# Altium schematic sheet HEADERS_JCTL.SchDoc: JCTL
size A3; Author: Silvio Navaretti; CompanyName: ARDUINO; DrawnBy: Silvio Navaretti; Engineer: Silvio Navaretti; Organization: ARDUINO; SheetNumber: 23; SheetTotal: 51; RevAuthor: Silvio Navaretti
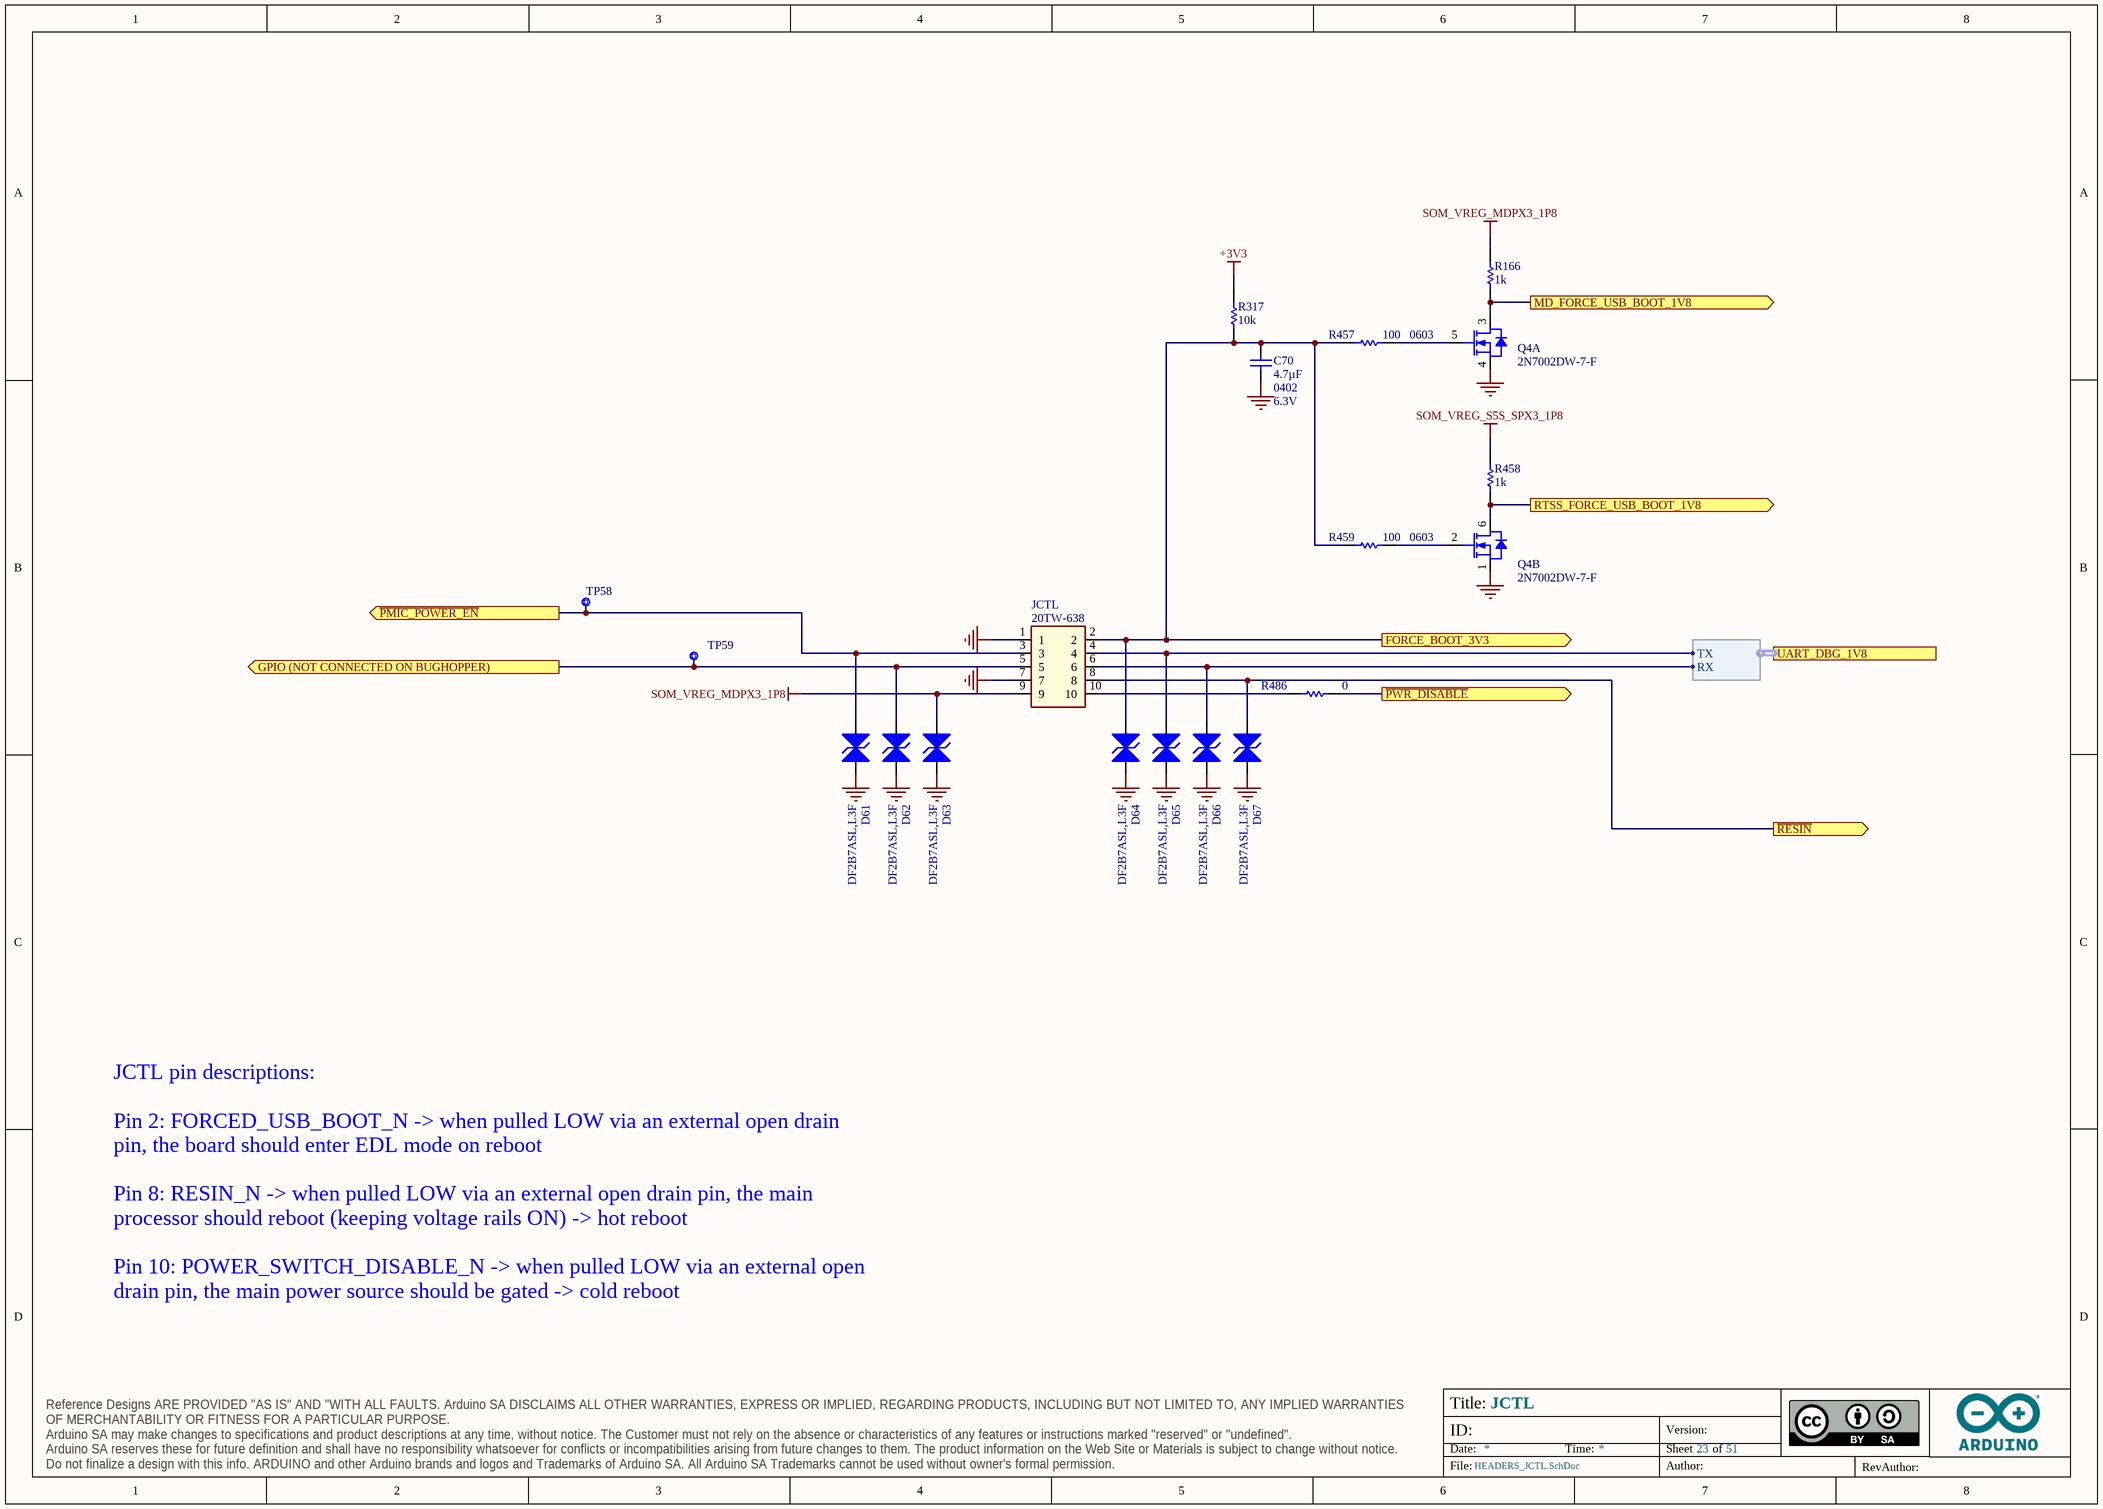
[diagram p0: HEADERS_JCTL.SchDoc]

## Parts
C70  value 4.7µF  Case Code (Imperial): 0402  Voltage: 6.3V  [CAP-0402]  (hidden comment: C1005A475M6R3NT)
D61  DF2B7ASL,L3F  [DF2B7ASL,L3F]
D62  DF2B7ASL,L3F  [DF2B7ASL,L3F]
D63  DF2B7ASL,L3F  [DF2B7ASL,L3F]
D64  DF2B7ASL,L3F  [DF2B7ASL,L3F]
D65  DF2B7ASL,L3F  [DF2B7ASL,L3F]
D66  DF2B7ASL,L3F  [DF2B7ASL,L3F]
D67  DF2B7ASL,L3F  [DF2B7ASL,L3F]
JCTL  20TW-638  [20TW-638]
Q4  2N7002DW-7-F  [SOT363]  (parts A,B of 2)
R166  value 1k  [RES-0201]  (hidden comment: RC0201FR-071KL)
R317  value 10k  [RES-0201]  (hidden comment: RC0201FR-0710KL)
R457  value 100  Case Code (Imperial): 0603  [RES-0603]  (hidden comment: CRCW0603100RFKEAC)
R458  value 1k  [RES-0201]  (hidden comment: RC0201FR-071KL)
R459  value 100  Case Code (Imperial): 0603  [RES-0603]  (hidden comment: CRCW0603100RFKEAC)
R486  value 0  [RES-0201]  (hidden comment: CRCW02010000Z0ED)
TP58  Test point 1.00mm  [TP-1.00MM]  (value not drawn)  (no BOM)
TP59  Test point 1.00mm  [TP-1.00MM]  (value not drawn)  (no BOM)

## Ports
FORCE_BOOT_3V3 (out), GPIO (NOT CONNECTED ON BUGHOPPER) (out), MD_FORCE_USB_BOOT_1V8 (out), RTSS_FORCE_USB_BOOT_1V8 (out), UART_DBG_1V8 (harness UART), ~{PMIC_POWER_EN} (out), ~{PWR_DISABLE} (out), ~{RESIN} (out)

## Harnesses
UART: TX, RX

## Nets
+3V3: R317.2
GND: C70.2 D61.1(A1) D62.1(A1) D63.1(A1) D64.1(A1) D65.1(A1) D66.1(A1) D67.1(A1) JCTL.1 JCTL.7 Q4.1(S) Q4.4(S)
SOM_VREG_MDPX3_1P8: D63.2(A2) JCTL.9 R166.1
SOM_VREG_S5S_SPX3_1P8: R458.1
FORCE_BOOT_3V3: C70.1 D64.2(A2) JCTL.2 R317.1 R457.2 R459.2 ; port FORCE_BOOT_3V3
GPIO (NOT CONNECTED ON BUGHOPPER): D62.2(A2) JCTL.5 TP59.X ; port GPIO (NOT CONNECTED ON BUGHOPPER)
MD_FORCE_USB_BOOT_1V8: Q4.3(D) R166.2 ; port MD_FORCE_USB_BOOT_1V8
~{PMIC_POWER_EN}: D61.2(A2) JCTL.3 TP58.X ; port ~{PMIC_POWER_EN}
~{PWR_DISABLE}: R486.1 ; port ~{PWR_DISABLE}
~{RESIN}: D67.2(A2) JCTL.8 ; port ~{RESIN}
RTSS_FORCE_USB_BOOT_1V8: Q4.6(D) R458.2 ; port RTSS_FORCE_USB_BOOT_1V8
NetD65_2: D65.2(A2) JCTL.4 ; port UART_DBG_1V8.TX
NetD66_2: D66.2(A2) JCTL.6 ; port UART_DBG_1V8.RX
NetJCTL_10: JCTL.10 R486.2
NetQ4_2: Q4.2(G) R459.1
NetQ4_5: Q4.5(G) R457.1

## Notes on the sheet
- JCTL pin descriptions:
  Pin 2: FORCED_USB_BOOT_N -> when pulled LOW via an external open drain pin, the board should enter EDL mode on reboot
  Pin 8: RESIN_N -> when pulled LOW via an external open drain pin, the main processor should reboot (keeping voltage rails ON) -> hot reboot
  Pin 10: POWER_SWITCH_DISABLE_N -> when pulled LOW via an external open drain pin, the main power source should be gated -> cold reboot
- Title:
- ID:
- Date:
- Time:
- Version:
- Sheet
- of
- RevAuthor:
- Reference Designs ARE PROVIDED "AS IS" AND "WITH ALL FAULTS. Arduino SA DISCLAIMS ALL OTHER WARRANTIES, EXPRESS OR IMPLIED, REGARDING PRODUCTS, INCLUDING BUT NOT LIMITED TO, ANY IMPLIED WARRANTIES OF MERCHANTABILITY OR FITNESS FOR A PARTICULAR PURPOSE.
  Arduino SA may make changes to specifications and product descriptions at any time, without notice. The Customer must not rely on the absence or characteristics of any features or instructions marked "reserved" or "undefined".
  Arduino SA reserves these for future definition and shall have no responsibility whatsoever for conflicts or incompatibilities arising from future changes to them. The product information on the Web Site or Materials is subject to change without notice.
  Do not finalize a design with this info. ARDUINO and other Arduino brands and logos and Trademarks of Arduino SA. All Arduino SA Trademarks cannot be used without owner's formal permission.
- File:
- Author:

## Library data of the parts
C70 = C0037-A.14: CAP CHIP 0402 4.7uF 20% 6V3 X5R; Manufacturer: Hottech; Code Arduino: 0833; Dielectric: X5R; Technology: Ceramic; Part Number: C1005A475M6R3NT; Manufacturer 2: Samsung Electro-Mechanics; Tolerance: 20%; Manufacturer 3: Murata Electronics; Part number 3: GRM155R60J475ME47D; Part number 2: CL05A475KQ5NRNC
D61-D67 = D0099-5: TVS BIDIRECTIONAL SMD Vr 5.5V, Vbr min 5.8V, 0.62x0.32mm; Manufacturer: TOSHIBA; Vforward max: 0V; Ireverse max: 1µA; Power max: 80W; Code Arduino: D0099; Vreverse max: 20V; V(BR) min: 5.8V; V(RWM) max: 5.5V; Part Number: DF2B7ASL,L3F
JCTL = J0570-A.1: CONN HEADER MALE 10POS 2x5 2.54mm SMD; Manufacturer: 4UCONN; Number of Contacts: 10; Connector Type: BOARD CONNECTOR; Code Arduino: J0570; Contact Material: Gold; Part Number: 20TW-638; Termination: SMD/SMT; Insulation Color: Black
Q4 = T0011-A.12: MOSFET 2N-CH 60V 0.32A SOT363; Manufacturer: Diodes Inc.; Device Type: Mosfet 2N-CH SMD; Code Arduino: A5500; Manufacturer 2: Nexperia; Manufacturer Part Number 2: 2N7002PS,115; Pin Count: 6; Part Number: 2N7002DW-7-F
R166 R458 = R0195-A.22: RES CHIP 0201 1k 1% 1/20W; Manufacturer: Yageo; Power: 50mW; Temperature coefficient: 200ppm; Code Arduino: R0195; Tolerance: 1%; Case Code (Imperial): 0201; Part Number: RC0201FR-071KL; Technology: Thick film
R317 = R0145-A.21: RES CHIP 0201 10k 1% 1/20W; Manufacturer: Yageo; Power: 50mW; Temperature coefficient: 200ppm; Code Arduino: R0145; Manufacturer 2: Samsung Electro-Mechanics; Tolerance: 1%; Case Code (Imperial): 0201; Part Number: RC0201FR-0710KL; Technology: Thick film
R457 R459 = R0105-A.22: RES CHIP 0603 100R 1% 1/10W; Manufacturer: Vishay; Power: 100mW; Temperature coefficient: 100ppm; Code Arduino: A5099; Part Number: CRCW0603100RFKEAC; Tolerance: 1%; Technology: Thick film
R486 = R0140-A.21: RES CHIP 0201 0R; Manufacturer: Vishay; Temperature coefficient: 0ppm; Code Arduino: R0140; Power: 50mW; Tolerance: 0%; Technology: Thick film; Case Code (Imperial): 0201; Part Number: CRCW02010000Z0ED
TP58 TP59 = UT0013-A.6: Part Number: This is not a component; Design Item ID: CMP-018-0005-A.3; Source: ut.SchLib; Manufacturer: This is not a component; Code Arduino: This is not a component; Pin Count: 1